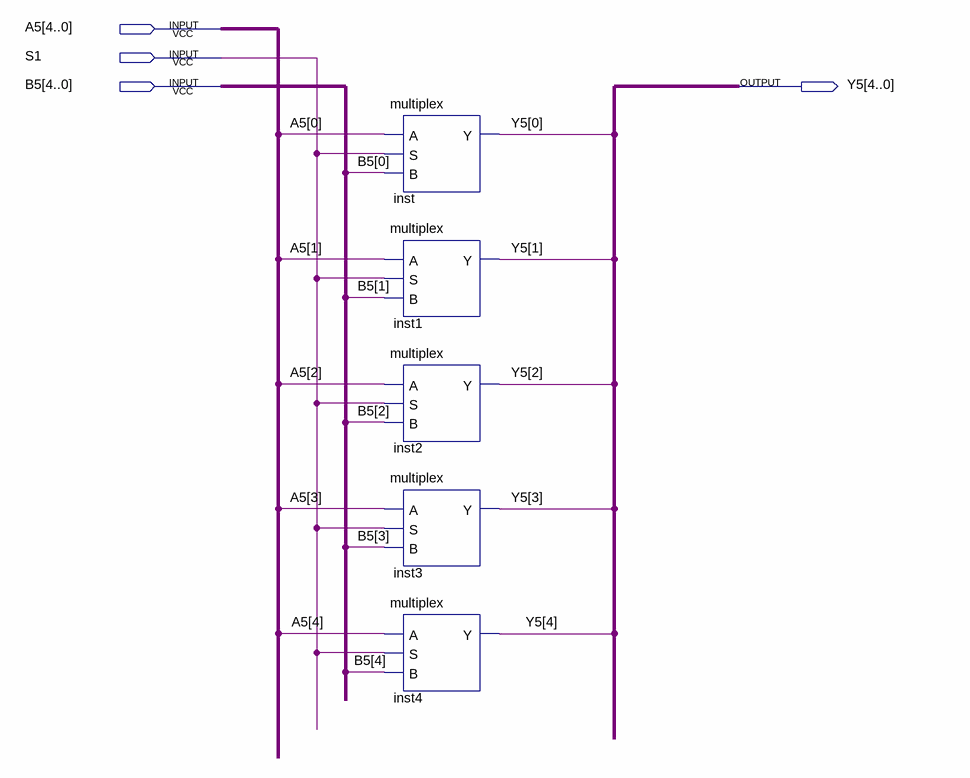
[diagram p0: schematic sheet]
// Quartus schematic multiplex5.bdf as structural Verilog: 5 symbols, 4 pins
module multiplex5 (
  input  [4:0] A5,
  input  S1,
  input  [4:0] B5,
  output [4:0] Y5
);

  multiplex inst (.A(A5[0]), .S(S1), .B(B5[0]), .Y(Y5[0]));
  multiplex inst1 (.A(A5[1]), .S(S1), .B(B5[1]), .Y(Y5[1]));
  multiplex inst2 (.A(A5[2]), .S(S1), .B(B5[2]), .Y(Y5[2]));
  multiplex inst3 (.A(A5[3]), .S(S1), .B(B5[3]), .Y(Y5[3]));
  multiplex inst4 (.A(A5[4]), .S(S1), .B(B5[4]), .Y(Y5[4]));
endmodule
